# Altium schematic sheet USB_SERIE.SchDoc
size A4; SheetNumber: 7; SheetTotal: 7; SPICEModelCacheZQRZJMEL: <root> / <DocumentId>ZQRZJMEL</DocumentId> / </root>
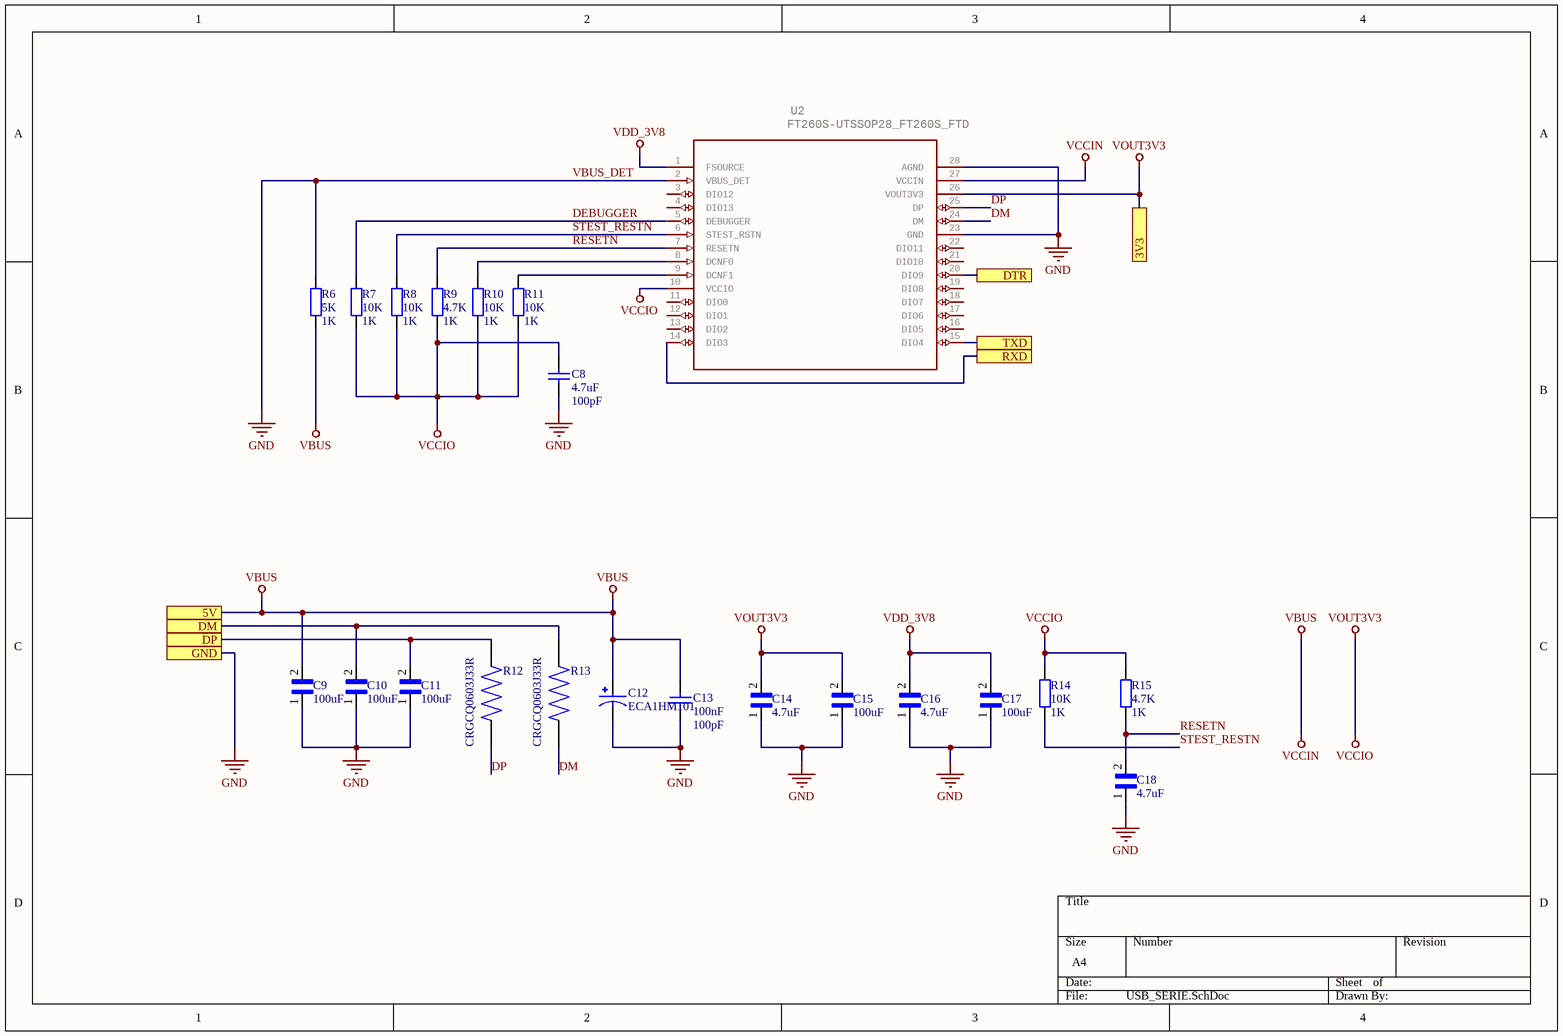
[diagram p0: USB_SERIE.SchDoc]

## Parts
C8  4.7uF  value 100pF  [RAD-0.3]
C9  100uF  [CAPC1608X90N]
C10  100uF  [CAPC1608X90N]
C11  100uF  [CAPC1608X90N]
C12  ECA1HM101  [CAPPRD350W60D800H1150]
C13  100nF  value 100pF  [RAD-0.3]
C14  4.7uF  [CAPC1608X94N]
C15  100uF  [CAPC1608X90N]
C16  4.7uF  [CAPC1608X94N]
C17  100uF  [CAPC1608X90N]
C18  4.7uF  [CAPC1608X94N]
R6  5K  value 1K  [AXIAL-0.4]
R7  10K  value 1K  [AXIAL-0.4]
R8  10K  value 1K  [AXIAL-0.4]
R9  4.7K  value 1K  [AXIAL-0.4]
R10  10K  value 1K  [AXIAL-0.4]
R11  10K  value 1K  [AXIAL-0.4]
R12  CRGCQ0603J33R  [RESC1608X55N]
R13  CRGCQ0603J33R  [RESC1608X55N]
R14  10K  value 1K  [AXIAL-0.4]
R15  4.7K  value 1K  [AXIAL-0.4]
U2  FT260S-UTSSOP28_FT260S_FTD  [SOP65P640X110-28N]

## Ports
3V3, 5V, DM, DP, DTR, GND, RXD, TXD

## Nets
VBUS: C9.2 C12.P C13.2 R6.1 U2.27(VCCIN) ; port 5V  [also labelled VCCIN]
VBUS_DET: C8.1 C9.1 C10.1 C11.1 C12.N C13.1 C14.1 C15.1 C16.1 C17.1 C18.1 R6.2 U2.2(VBUS_DET) U2.23(GND) U2.28(AGND) ; port GND  [also labelled GND]
VCCIO: C8.2 C14.2 C15.2 R7.1 R8.1 R9.1 R10.1 R11.1 R14.2 R15.2 U2.10(VCCIO) U2.26(VOUT3V3) ; port 3V3  [also labelled VOUT3V3]
VDD_3V8: C16.2 C17.2 U2.1(FSOURCE)
DEBUGGER: R7.2 U2.5(DEBUGGER)
DM: C10.2 R13.2 ; port DM
DM: R13.1 U2.24(DM)  [a separate net that carries the same name]
DP: C11.2 R12.2 ; port DP
DP: R12.1 U2.25(DP)  [a separate net that carries the same name]
DTR: U2.20(DIO9) ; port DTR
RESETN: C18.2 R9.2 R15.1 U2.7(RESETN)
RXD: U2.14(DIO3) ; port RXD
STEST_RESTN: R8.2 R14.1 U2.6(STEST_RSTN)
TXD: U2.15(DIO4) ; port TXD
NetR10_2: R10.2 U2.8(DCNF0)
NetR11_2: R11.2 U2.9(DCNF1)

Not connected (* = marked no-connect by the designer): U2 3(DIO12) 4(DIO13) 11(DIO0) 12(DIO1) 13(DIO2) 16(DIO5) 17(DIO6) 18(DIO7) 19(DIO8) 21(DIO10) 22(DIO11)

## Library data of the parts
C8 C13 = Cap: Capacitor; Published: 8-Jun-2000; LatestRevisionDate: 17-Jul-2002; LatestRevisionNote: Re-released for DXP Platform.; PackageReference: RAD-0.3; Publisher: Altium Limited; PackageDescription: Radial Cap, Thru-Hole; 2 Leads; 0.3 in Pin Spacing
C9-C11 C15 C17 = 06033C103KAT2A: Cap Ceramic 0.01uF 25V X7R 10% Pad SMD 0603 125C T/R; Package: None; Price: None; Value: *; MP: 06033C103KAT2A; Availability: Unavailable
C12 = ECA1HM101: 100ÂµF 50V Aluminum Electrolytic Capacitors Radial, Can 2000 Hrs @ 85Â°C; MF: Panasonic; Check_prices: https://www.snapeda.com/parts/ECA1HM101/Panasonic/view-part/4478734/?ref=eda; SnapEDA_Link: https://www.snapeda.com/parts/ECA1HM101/Panasonic/view-part/4478734/?ref=snap; Price: None; Availability: No availability data; Package: RADIAL-2 Panasonic; MP: ECA1HM101; Value: *
C14 C16 C18 = 06036D475KAT4A: Cap Ceramic 4.7uF 6.3V X5R 10% SMD 0603 85Â°C Paper T/R; Package: None; Price: None; Value: *; MP: 06036D475KAT4A; Availability: Unavailable
R6-R11 R14 R15 = Res2: Resistor; Published: 8-Jun-2000; LatestRevisionDate: 17-Jul-2002; LatestRevisionNote: Re-released for DXP Platform.; PackageReference: AXIAL-0.4; Publisher: Altium Limited; PackageDescription: Axial Device, Thru-Hole; 2 Leads; 0.4 in Pin Spacing
R12 R13 = CRGCQ0603J33R: Fixed Resistor CRGCQ 0603 33R 5%; Package: None; Price: None; Value: *; MP: CRGCQ0603J33R; Availability: Unavailable
U2 = FT260S-UTSSOP28_FT260S_FTD: Mfr_Name: FTDI, Future Technology Devices International Ltd; GateName_1: A; SymbolName_1: FT260S-U; DeviceName: TSSOP28_FT260S_FTD; LibraryName: 2024-10-31_11-49-55_Library; DeviceSetName: FT260S-U; Package: TSSOP28_FT260S_FTD; Copyright: Copyright (C) 2024 Ultra Librarian. All rights reserved.; Manufacturer_Part_Number: FT260S-U